# Altium schematic sheet APP_1_ADC_m.SchDoc
size Tabloid; SheetNumber: 9; SheetTotal: 16; Sheet_Name: ADC; Size: 11x17
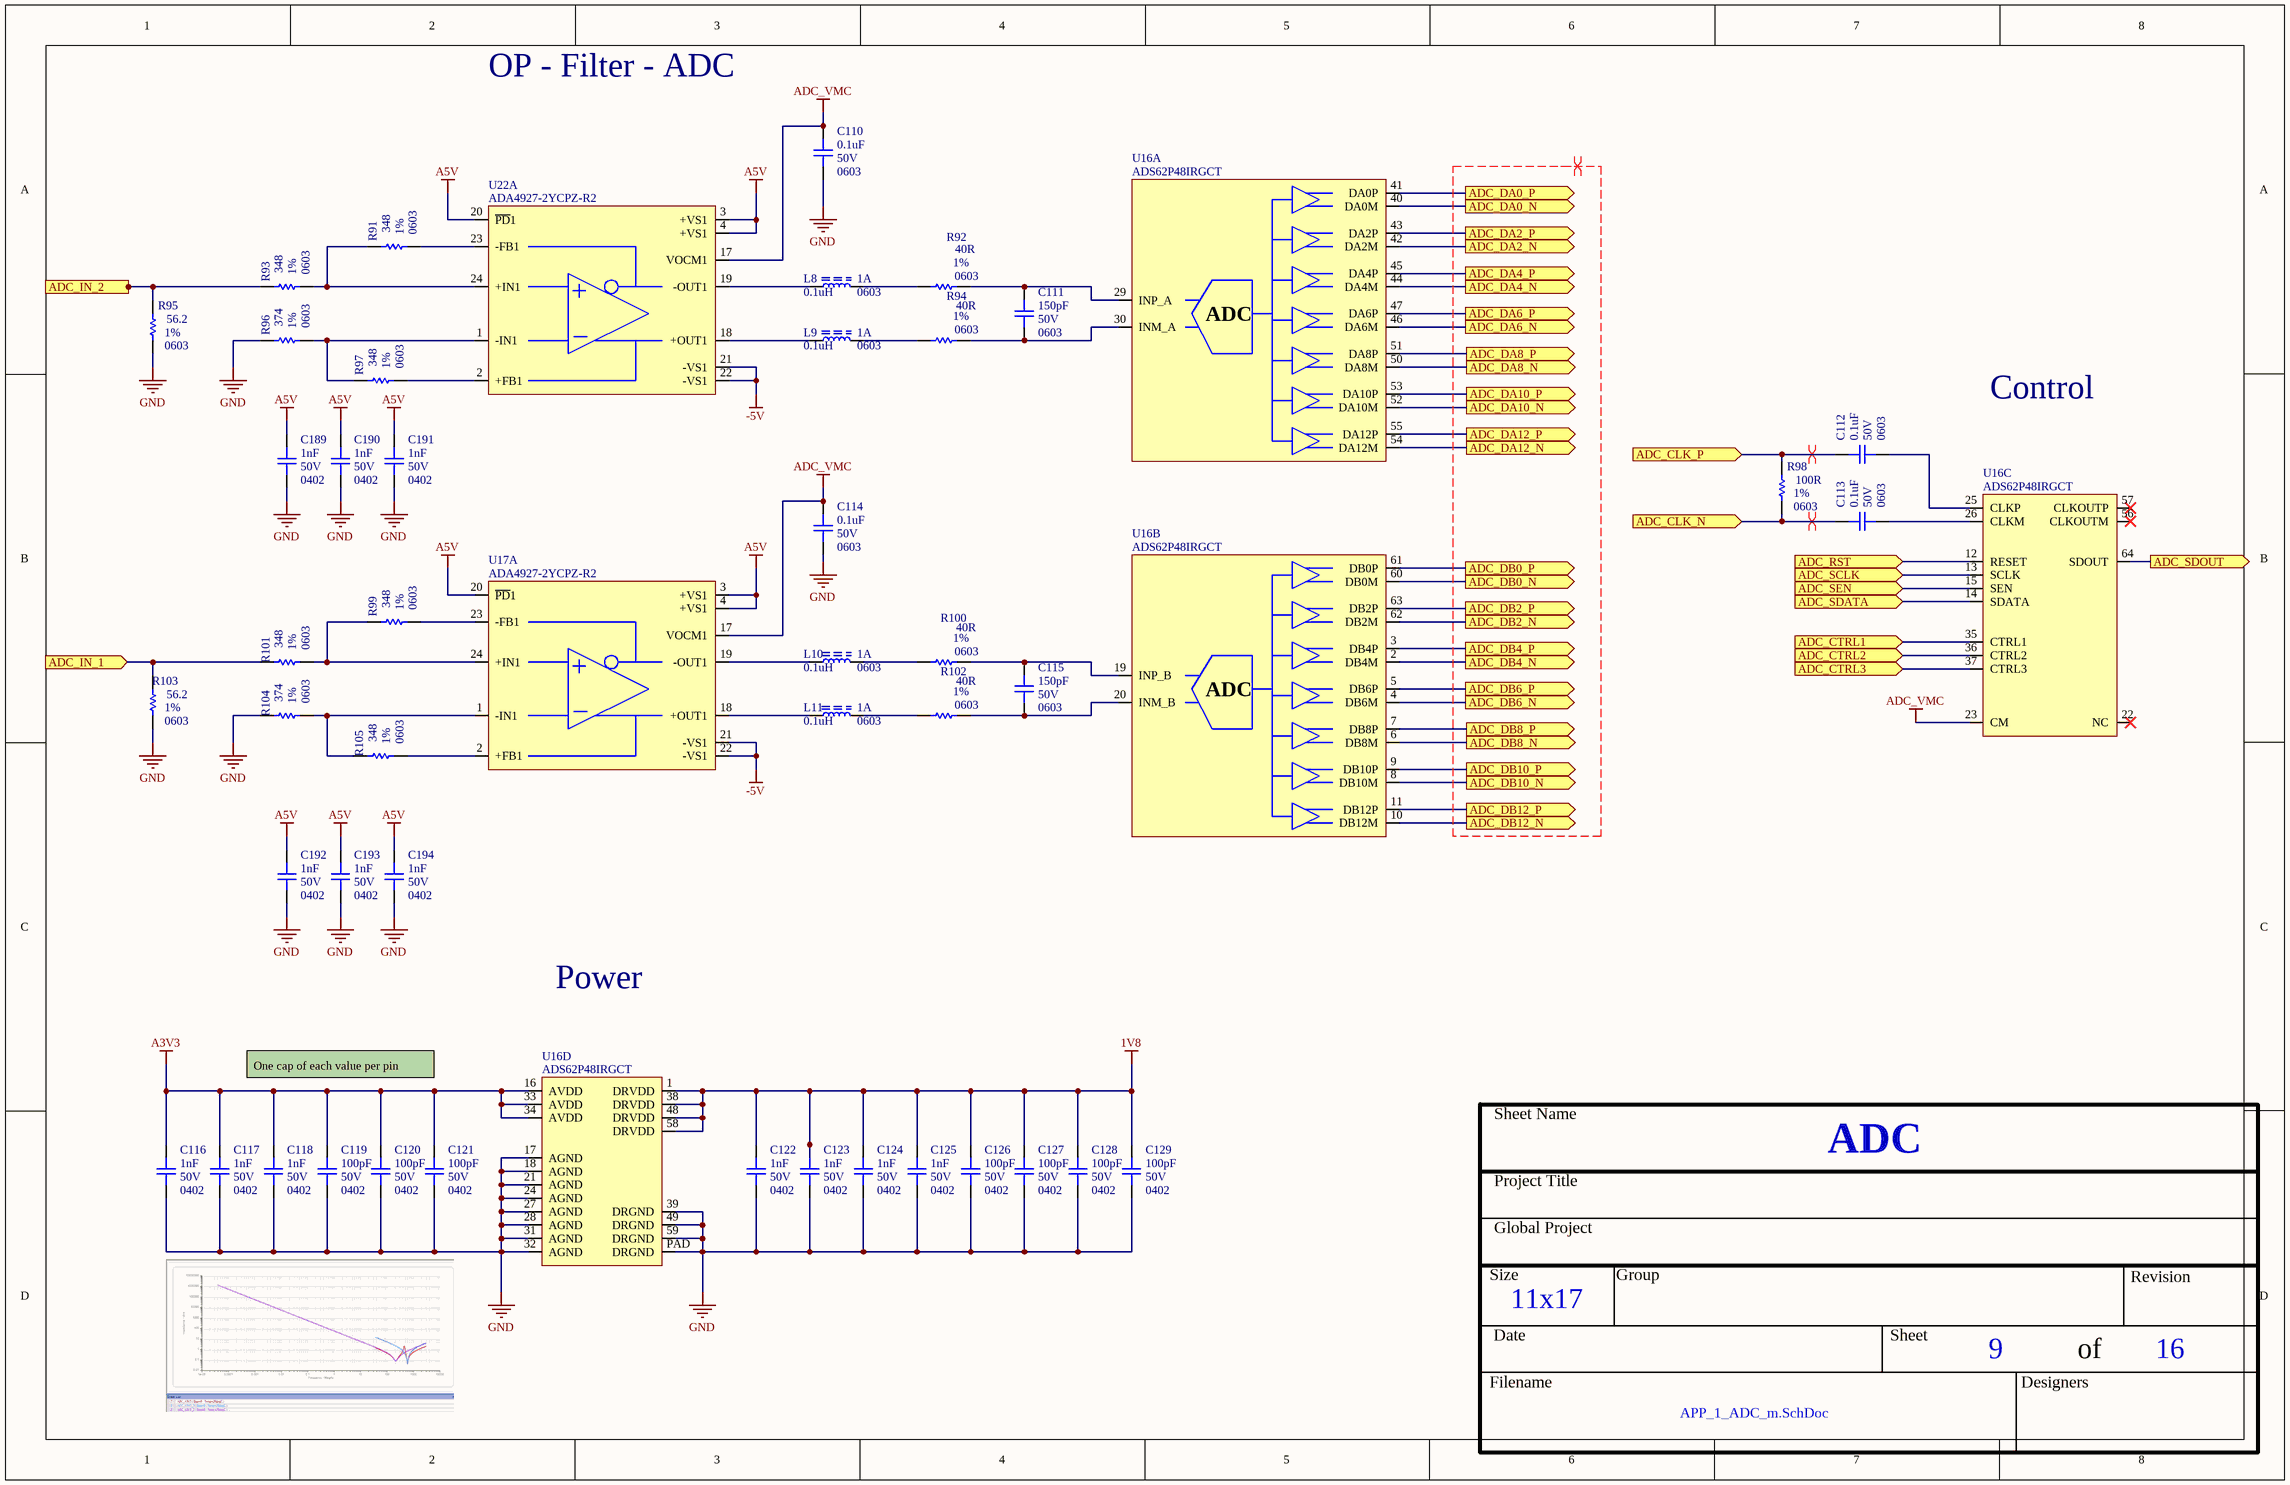
[diagram p0: APP_1_ADC_m.SchDoc]

## Parts
C110  value 0.1uF  Voltage: 50V  Package: 0603  [CAP_0603]  (hidden comment: CAP - 0603)
C111  value 150pF  Voltage: 50V  Package: 0603  [CAP_0603]  (hidden comment: CAP - 0603)
C112  value 0.1uF  Voltage: 50V  Package: 0603  [CAP_0603]  (hidden comment: CAP - 0603)
C113  value 0.1uF  Voltage: 50V  Package: 0603  [CAP_0603]  (hidden comment: CAP - 0603)
C114  value 0.1uF  Voltage: 50V  Package: 0603  [CAP_0603]  (hidden comment: CAP - 0603)
C115  value 150pF  Voltage: 50V  Package: 0603  [CAP_0603]  (hidden comment: CAP - 0603)
C116  value 1nF  Voltage: 50V  Package: 0402  [CAP_0402]  (hidden comment: CAP - 0402)
C117  value 1nF  Voltage: 50V  Package: 0402  [CAP_0402]  (hidden comment: CAP - 0402)
C118  value 1nF  Voltage: 50V  Package: 0402  [CAP_0402]  (hidden comment: CAP - 0402)
C119  value 100pF  Voltage: 50V  Package: 0402  [CAP_0402]  (hidden comment: CAP - 0402)
C120  value 100pF  Voltage: 50V  Package: 0402  [CAP_0402]  (hidden comment: CAP - 0402)
C121  value 100pF  Voltage: 50V  Package: 0402  [CAP_0402]  (hidden comment: CAP - 0402)
C122  value 1nF  Voltage: 50V  Package: 0402  [CAP_0402]  (hidden comment: CAP - 0402)
C123  value 1nF  Voltage: 50V  Package: 0402  [CAP_0402]  (hidden comment: CAP - 0402)
C124  value 1nF  Voltage: 50V  Package: 0402  [CAP_0402]  (hidden comment: CAP - 0402)
C125  value 1nF  Voltage: 50V  Package: 0402  [CAP_0402]  (hidden comment: CAP - 0402)
C126  value 100pF  Voltage: 50V  Package: 0402  [CAP_0402]  (hidden comment: CAP - 0402)
C127  value 100pF  Voltage: 50V  Package: 0402  [CAP_0402]  (hidden comment: CAP - 0402)
C128  value 100pF  Voltage: 50V  Package: 0402  [CAP_0402]  (hidden comment: CAP - 0402)
C129  value 100pF  Voltage: 50V  Package: 0402  [CAP_0402]  (hidden comment: CAP - 0402)
C189  value 1nF  Voltage: 50V  Package: 0402  [CAP_0402]  (hidden comment: CAP - 0402)
C190  value 1nF  Voltage: 50V  Package: 0402  [CAP_0402]  (hidden comment: CAP - 0402)
C191  value 1nF  Voltage: 50V  Package: 0402  [CAP_0402]  (hidden comment: CAP - 0402)
C192  value 1nF  Voltage: 50V  Package: 0402  [CAP_0402]  (hidden comment: CAP - 0402)
C193  value 1nF  Voltage: 50V  Package: 0402  [CAP_0402]  (hidden comment: CAP - 0402)
C194  value 1nF  Voltage: 50V  Package: 0402  [CAP_0402]  (hidden comment: CAP - 0402)
L8  value 0.1uH  Current: 1A  Package: 0603  [FER_0603]  (hidden comment: FER - 0603)
L9  value 0.1uH  Current: 1A  Package: 0603  [FER_0603]  (hidden comment: FER - 0603)
L10  value 0.1uH  Current: 1A  Package: 0603  [FER_0603]  (hidden comment: FER - 0603)
L11  value 0.1uH  Current: 1A  Package: 0603  [FER_0603]  (hidden comment: FER - 0603)
R91  value 348  Package: 0603  Precision: 1%  [RES_0603]  (hidden comment: RES - 0603)
R92  value 40R  Package: 0603  Precision: 1%  [RES_0603]  (hidden comment: RES - 0603)
R93  value 348  Package: 0603  Precision: 1%  [RES_0603]  (hidden comment: RES - 0603)
R94  value 40R  Package: 0603  Precision: 1%  [RES_0603]  (hidden comment: RES - 0603)
R95  value 56.2  Package: 0603  Precision: 1%  [RES_0603]  (hidden comment: RES - 0603)
R96  value 374  Package: 0603  Precision: 1%  [RES_0603]  (hidden comment: RES - 0603)
R97  value 348  Package: 0603  Precision: 1%  [RES_0603]  (hidden comment: RES - 0603)
R98  value 100R  Package: 0603  Precision: 1%  [RES_0603]  (hidden comment: RES - 0603)
R99  value 348  Package: 0603  Precision: 1%  [RES_0603]  (hidden comment: RES - 0603)
R100  value 40R  Package: 0603  Precision: 1%  [RES_0603]  (hidden comment: RES - 0603)
R101  value 348  Package: 0603  Precision: 1%  [RES_0603]  (hidden comment: RES - 0603)
R102  value 40R  Package: 0603  Precision: 1%  [RES_0603]  (hidden comment: RES - 0603)
R103  value 56.2  Package: 0603  Precision: 1%  [RES_0603]  (hidden comment: RES - 0603)
R104  value 374  Package: 0603  Precision: 1%  [RES_0603]  (hidden comment: RES - 0603)
R105  value 348  Package: 0603  Precision: 1%  [RES_0603]  (hidden comment: RES - 0603)
U16  ADS62P48IRGCT  [ADC_ADS62P48IRGCT]  (parts A,B,C,D of 4)
U17  ADA4927-2YCPZ-R2  [OPAMP_ADA4927-2YCPZ-R2]  (part A of 2)
U22  ADA4927-2YCPZ-R2  [OPAMP_ADA4927-2YCPZ-R2]  (part A of 2)

## Ports
ADC_CLK_N (in), ADC_CLK_P (in), ADC_CTRL1 (in), ADC_CTRL2 (in), ADC_CTRL3 (in), ADC_DA0_N (out), ADC_DA0_P (out), ADC_DA2_N (out), ADC_DA2_P (out), ADC_DA4_N (out), ADC_DA4_P (out), ADC_DA6_N (out), ADC_DA6_P (out), ADC_DA8_N (out), ADC_DA8_P (out), ADC_DA10_N (out), ADC_DA10_P (out), ADC_DA12_N (out), ADC_DA12_P (out), ADC_DB0_N (out), ADC_DB0_P (out), ADC_DB2_N (out), ADC_DB2_P (out), ADC_DB4_N (out), ADC_DB4_P (out), ADC_DB6_N (out), ADC_DB6_P (out), ADC_DB8_N (out), ADC_DB8_P (out), ADC_DB10_N (out), ADC_DB10_P (out), ADC_DB12_N (out), ADC_DB12_P (out), ADC_IN_1 (in, see APP_1_Connectors_m[5A]), ADC_IN_2 (in, see APP_1_Connectors_m[5A]), ADC_RST (in), ADC_SCLK (in), ADC_SDATA (in), ADC_SDOUT (out), ADC_SEN (in)

## Nets
1V8: C122.2 C123.2 C124.2 C125.2 C126.2 C127.2 C128.2 C129.2 U16.1(DRVDD) U16.38(DRVDD) U16.48(DRVDD) U16.58(DRVDD)
-5V: U17.21(-VS1) U17.22(-VS1) U22.21(-VS1) U22.22(-VS1)
A3V3: C116.2 C117.2 C118.2 C119.2 C120.2 C121.2 U16.16(AVDD) U16.33(AVDD) U16.34(AVDD)
A5V: C189.2 C190.2 C191.2 C192.2 C193.2 C194.2 U17.3(+VS1) U17.4(+VS1) U17.20(~{PD}1) U22.3(+VS1) U22.4(+VS1) U22.20(~{PD}1)
ADC_VMC: C110.2 C114.2 U16.23(CM) U17.17(VOCM1) U22.17(VOCM1)
GND: C110.1 C114.1 C116.1 C117.1 C118.1 C119.1 C120.1 C121.1 C122.1 C123.1 C124.1 C125.1 C126.1 C127.1 C128.1 C129.1 C189.1 C190.1 C191.1 C192.1 C193.1 C194.1 R95.1 R96.2 R103.1 R104.2 U16.17(AGND) U16.18(AGND) U16.21(AGND) U16.24(AGND) U16.27(AGND) U16.28(AGND) U16.31(AGND) U16.32(AGND) U16.39(DRGND) U16.49(DRGND) U16.59(DRGND) U16.PAD(DRGND)
ADC_CLK_N: C113.2 R98.1 ; port ADC_CLK_N
ADC_CLK_P: C112.2 R98.2 ; port ADC_CLK_P
ADC_CTRL1: U16.35(CTRL1) ; port ADC_CTRL1
ADC_CTRL2: U16.36(CTRL2) ; port ADC_CTRL2
ADC_CTRL3: U16.37(CTRL3) ; port ADC_CTRL3
ADC_DA0_N: U16.40(DA0M) ; port ADC_DA0_N
ADC_DA0_P: U16.41(DA0P) ; port ADC_DA0_P
ADC_DA2_N: U16.42(DA2M) ; port ADC_DA2_N
ADC_DA2_P: U16.43(DA2P) ; port ADC_DA2_P
ADC_DA4_N: U16.44(DA4M) ; port ADC_DA4_N
ADC_DA4_P: U16.45(DA4P) ; port ADC_DA4_P
ADC_DA6_N: U16.46(DA6M) ; port ADC_DA6_N
ADC_DA6_P: U16.47(DA6P) ; port ADC_DA6_P
ADC_DA8_N: U16.50(DA8M) ; port ADC_DA8_N
ADC_DA8_P: U16.51(DA8P) ; port ADC_DA8_P
ADC_DA10_N: U16.52(DA10M) ; port ADC_DA10_N
ADC_DA10_P: U16.53(DA10P) ; port ADC_DA10_P
ADC_DA12_N: U16.54(DA12M) ; port ADC_DA12_N
ADC_DA12_P: U16.55(DA12P) ; port ADC_DA12_P
ADC_DB0_N: U16.60(DB0M) ; port ADC_DB0_N
ADC_DB0_P: U16.61(DB0P) ; port ADC_DB0_P
ADC_DB2_N: U16.62(DB2M) ; port ADC_DB2_N
ADC_DB2_P: U16.63(DB2P) ; port ADC_DB2_P
ADC_DB4_N: U16.2(DB4M) ; port ADC_DB4_N
ADC_DB4_P: U16.3(DB4P) ; port ADC_DB4_P
ADC_DB6_N: U16.4(DB6M) ; port ADC_DB6_N
ADC_DB6_P: U16.5(DB6P) ; port ADC_DB6_P
ADC_DB8_N: U16.6(DB8M) ; port ADC_DB8_N
ADC_DB8_P: U16.7(DB8P) ; port ADC_DB8_P
ADC_DB10_N: U16.8(DB10M) ; port ADC_DB10_N
ADC_DB10_P: U16.9(DB10P) ; port ADC_DB10_P
ADC_DB12_N: U16.10(DB12M) ; port ADC_DB12_N
ADC_DB12_P: U16.11(DB12P) ; port ADC_DB12_P
ADC_IN_1: R101.2 R103.2 ; port ADC_IN_1
ADC_IN_2: R93.2 R95.2 ; port ADC_IN_2
ADC_RST: U16.12(RESET) ; port ADC_RST
ADC_SCLK: U16.13(SCLK) ; port ADC_SCLK
ADC_SDATA: U16.14(SDATA) ; port ADC_SDATA
ADC_SDOUT: U16.64(SDOUT) ; port ADC_SDOUT
ADC_SEN: U16.15(SEN) ; port ADC_SEN
NetC111_1: C111.1 R94.1 U16.30(INM_A)
NetC111_2: C111.2 R92.1 U16.29(INP_A)
NetC112_1: C112.1 U16.25(CLKP)
NetC113_1: C113.1 U16.26(CLKM)
NetC115_1: C115.1 R102.1 U16.20(INM_B)
NetC115_2: C115.2 R100.1 U16.19(INP_B)
NetL8_1: L8.1 R92.2
NetL8_2: L8.2 U22.19(-OUT1)
NetL9_1: L9.1 R94.2
NetL9_2: L9.2 U22.18(+OUT1)
NetL10_1: L10.1 R100.2
NetL10_2: L10.2 U17.19(-OUT1)
NetL11_1: L11.1 R102.2
NetL11_2: L11.2 U17.18(+OUT1)
NetR91_1: R91.1 U22.23(-FB1)
NetR91_2: R91.2 R93.1 U22.24(+IN1)
NetR96_1: R96.1 R97.2 U22.1(-IN1)
NetR97_1: R97.1 U22.2(+FB1)
NetR99_1: R99.1 U17.23(-FB1)
NetR99_2: R99.2 R101.1 U17.24(+IN1)
NetR104_1: R104.1 R105.2 U17.1(-IN1)
NetR105_1: R105.1 U17.2(+FB1)

Not connected (* = marked no-connect by the designer): U16 22(NC)* 56(CLKOUTM)* 57(CLKOUTP)*

## Layout directives
differential pair: (no net found under the mark), ADC_CLK_N, ADC_CLK_P

## Notes on the sheet
- OP - Filter - ADC
- Control
- Power
- One cap of each value per pin
- Sheet Name
- Project Title
- Global Project
- Size
- Group
- Revision
- Date
- Sheet
- of
- Filename
- Designers
- (in symbol ADC_ADS62P48IRGCT, part A) ADC
- (in symbol ADC_ADS62P48IRGCT, part B) ADC

## Library data of the parts
C110-C115 = CAP - 0603: Precision: 10%; Current: *; CreatedBy: Jonathan Bouchard; Power: *
C116-C129 C189-C194 = CAP - 0402: Precision: 10%; Current: *; CreatedBy: Jonathan Bouchard; Power: *
U16 = ADC_ADS62P48IRGCT: ADC - 14 BIT 210MSPS SUAL - VQFN-64; Voltage: 3.15 V ~ 3.6 V / 1.7 V ~ 1.9 V; Mfg: Texas Instruments; Precision: 14 Bit; Current: *; Power: *; Mfg Part Number: ADS62P48IRGCT; HelpURL: http://www.ti.com/lit/ds/symlink/ads62p48.pdf; CreatedBy: Jonathan Bouchard; Temperature: -40°C ~ 85°C; Value: *; Package: VQFN-64; Supplier 1: Digikey; Supplier Part Number 1: 296-24611-1-ND
U17 U22 = OPAMP_ADA4927-2YCPZ-R2: OPAMP - CFA 2.3GHZ - QFN-24; Voltage: 4.5 V ~ 11 V, ±2.25 V ~ 5.5 V; Current: 65mA; Mfg: Analog Devices; Power: *; Mfg Part Number: ADA4927-2YCPZ-R2; HelpURL: http://www.analog.com/media/en/technical-documentation/data-sheets/ADA4927-1_4927-2.pdf; CreatedBy: Jonathan Bouchard; Temperature: -40°C ~ 105°C; Value: *; Precision: *; Package: QFN-24; Supplier 1: Digikey; Supplier Part Number 1: ADA4927-2YCPZ-R2CT-ND
L8-L11 = FER - 0603: Voltage: *; CreatedBy: Jonathan Bouchard; Power: *; Precision: *
R91-R105 = RES - 0603: Current: *; CreatedBy: Jonathan Bouchard